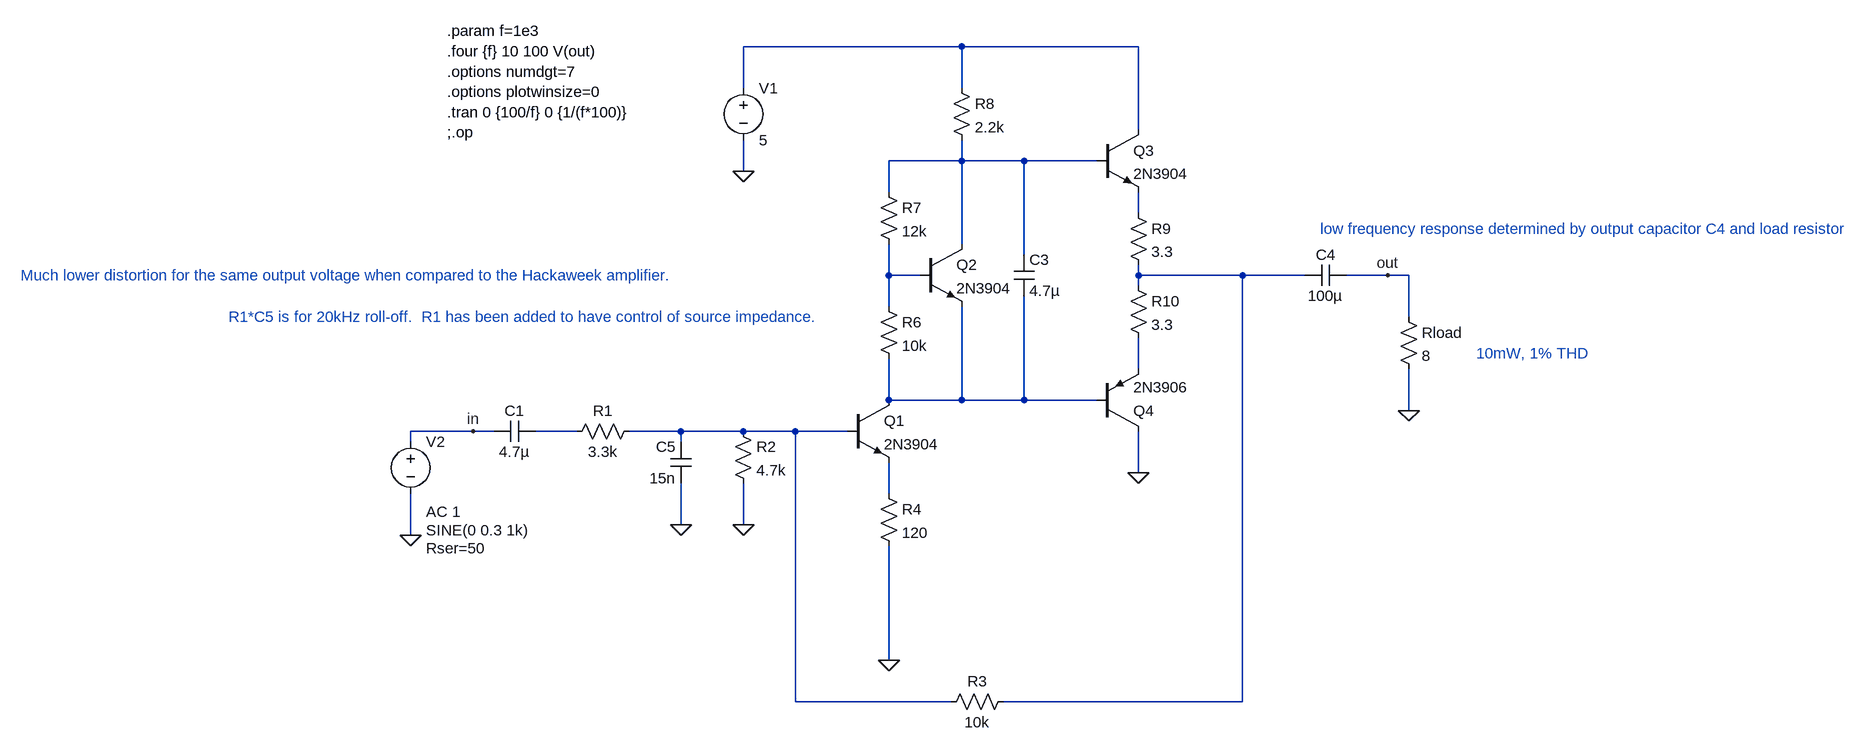
[diagram p0: schematic W.Hayward_EMRFD_p.12.asc]
W.Hayward_EMRFD_p.12.asc, the LTspice schematic file:
Version 4
SHEET 1 1748 740
WIRE 304 -384 -32 -384
WIRE 576 -384 304 -384
WIRE -32 -320 -32 -384
WIRE 304 -320 304 -384
WIRE 576 -256 576 -384
WIRE 304 -208 304 -240
WIRE 304 -208 192 -208
WIRE 400 -208 304 -208
WIRE 512 -208 400 -208
WIRE -32 -192 -32 -240
WIRE 192 -160 192 -208
WIRE 576 -128 576 -160
WIRE 304 -80 304 -208
WIRE 400 -64 400 -208
WIRE 192 -32 192 -80
WIRE 240 -32 192 -32
WIRE 576 -32 576 -48
WIRE 736 -32 576 -32
WIRE 832 -32 736 -32
WIRE 960 -32 896 -32
WIRE 992 -32 960 -32
WIRE 576 -16 576 -32
WIRE 192 16 192 -32
WIRE 992 32 992 -32
WIRE 576 112 576 64
WIRE 192 160 192 96
WIRE 304 160 304 16
WIRE 304 160 192 160
WIRE 400 160 400 0
WIRE 400 160 304 160
WIRE 512 160 400 160
WIRE 992 176 992 112
WIRE -448 208 -544 208
WIRE -416 208 -448 208
WIRE -288 208 -352 208
WIRE -128 208 -208 208
WIRE -32 208 -128 208
WIRE 48 208 -32 208
WIRE 128 208 48 208
WIRE -544 224 -544 208
WIRE -128 224 -128 208
WIRE 576 272 576 208
WIRE 192 304 192 256
WIRE -128 352 -128 288
WIRE -32 352 -32 288
WIRE -544 368 -544 304
WIRE 192 560 192 384
WIRE 48 624 48 208
WIRE 288 624 48 624
WIRE 736 624 736 -32
WIRE 736 624 368 624
FLAG -544 368 0
FLAG -32 352 0
FLAG 192 560 0
FLAG 576 272 0
FLAG -32 -192 0
FLAG 992 176 0
FLAG 960 -32 out
FLAG -448 208 in
FLAG -128 352 0
SYMBOL cap -352 192 R90
WINDOW 0 0 32 VBottom 2
WINDOW 3 32 32 VTop 2
SYMATTR InstName C1
SYMATTR Value 4.7µ
SYMBOL res -48 192 R0
SYMATTR InstName R2
SYMATTR Value 4.7k
SYMBOL res 384 608 R90
WINDOW 0 0 56 VBottom 2
WINDOW 3 32 56 VTop 2
SYMATTR InstName R3
SYMATTR Value 10k
SYMBOL res 176 288 R0
SYMATTR InstName R4
SYMATTR Value 120
SYMBOL npn 128 160 R0
SYMATTR InstName Q1
SYMATTR Value 2N3904
SYMBOL res 176 0 R0
SYMATTR InstName R6
SYMATTR Value 10k
SYMBOL res 176 -176 R0
SYMATTR InstName R7
SYMATTR Value 12k
SYMBOL npn 240 -80 R0
SYMATTR InstName Q2
SYMATTR Value 2N3904
SYMBOL res 288 -336 R0
SYMATTR InstName R8
SYMATTR Value 2.2k
SYMBOL npn 512 -256 R0
SYMATTR InstName Q3
SYMATTR Value 2N3904
SYMBOL res 560 -144 R0
SYMATTR InstName R9
SYMATTR Value 3.3
SYMBOL res 560 -32 R0
SYMATTR InstName R10
SYMATTR Value 3.3
SYMBOL pnp 512 208 M180
SYMATTR InstName Q4
SYMATTR Value 2N3906
SYMBOL voltage -32 -336 R0
WINDOW 123 0 0 Left 0
WINDOW 39 0 0 Left 0
SYMATTR InstName V1
SYMATTR Value 5
SYMBOL voltage -544 208 R0
WINDOW 3 24 152 Left 2
WINDOW 123 24 124 Left 2
WINDOW 39 24 180 Left 2
SYMATTR Value SINE(0 0.3 1k)
SYMATTR Value2 AC 1
SYMATTR SpiceLine Rser=50
SYMATTR InstName V2
SYMBOL cap 384 -64 R0
SYMATTR InstName C3
SYMATTR Value 4.7µ
SYMBOL cap 896 -48 R90
WINDOW 0 0 32 VBottom 2
WINDOW 3 32 32 VTop 2
SYMATTR InstName C4
SYMATTR Value 100µ
SYMBOL res 976 16 R0
SYMATTR InstName Rload
SYMATTR Value 8
SYMBOL cap -112 288 R180
WINDOW 0 24 56 Left 2
WINDOW 3 24 8 Left 2
SYMATTR InstName C5
SYMATTR Value 15n
SYMBOL res -192 192 R90
WINDOW 0 0 56 VBottom 2
WINDOW 3 32 56 VTop 2
SYMATTR InstName R1
SYMATTR Value 3.3k
TEXT 856 -104 Left 2 ;low frequency response determined by output capacitor C4 and load resistor
TEXT -824 32 Left 2 ;R1*C5 is for 20kHz roll-off.  R1 has been added to have control of source impedance.
TEXT -488 -408 Left 2 !.param f=1e3\n.four {f} 10 100 V(out)\n.options numdgt=7\n.options plotwinsize=0\n.tran 0 {100/f} 0 {1/(f*100)}\n;.op
TEXT -1144 -32 Left 2 ;Much lower distortion for the same output voltage when compared to the Hackaweek amplifier.
TEXT 1096 88 Left 2 ;10mW, 1% THD

The netlist it stands for:
* W.Hayward_EMRFD_p.12.asc
C1 N008 in 4.7µ
R2 N009 0 4.7k
R3 N005 N009 10k
R4 N010 0 120
Q1 N007 N009 N010 0 2N3904
R6 N004 N007 10k
R7 N002 N004 12k
Q2 N002 N004 N007 0 2N3904
R8 N001 N002 2.2k
Q3 N001 N002 N003 0 2N3904
R9 N003 N005 3.3
R10 N005 N006 3.3
Q4 0 N007 N006 0 2N3906
V1 N001 0 5
V2 in 0 SINE(0 0.3 1k) AC 1 Rser=50
C3 N002 N007 4.7µ
C4 out N005 100µ
Rload out 0 8
C5 0 N009 15n
R1 N009 N008 3.3k
.model NPN NPN
.model PNP PNP
.lib standard.bjt
* low frequency response determined by output capacitor C4 and load resistor
* R1*C5 is for 20kHz roll-off.  R1 has been added to have control of source impedance.
.param f=1e3
.four {f} 10 100 V(out)
.options numdgt=7
.options plotwinsize=0
.tran 0 {100/f} 0 {1/(f*100)}
;.op
* Much lower distortion for the same output voltage when compared to the Hackaweek amplifier.
* 10mW, 1% THD
.backanno
.end